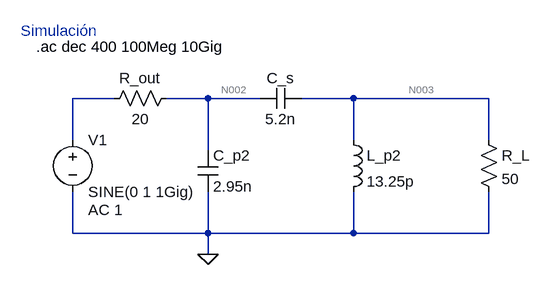
[diagram p0: schematic TP1 - Acoplamiento PI.asc]
TP1 - Acoplamiento PI.asc, the LTspice schematic file:
Version 4
SHEET 1 880 680
WIRE -192 16 -256 16
WIRE -48 16 -112 16
WIRE 32 16 -48 16
WIRE 176 16 96 16
WIRE 384 16 176 16
WIRE -256 80 -256 16
WIRE 176 80 176 16
WIRE 384 80 384 16
WIRE -48 96 -48 16
WIRE -256 224 -256 160
WIRE -48 224 -48 160
WIRE -48 224 -256 224
WIRE 176 224 176 160
WIRE 176 224 -48 224
WIRE 384 224 384 160
WIRE 384 224 176 224
WIRE -48 256 -48 224
FLAG -48 256 0
SYMBOL ind 160 64 R0
SYMATTR InstName L_p2
SYMATTR Value 13.25p
SYMBOL cap 96 0 R90
WINDOW 0 0 32 VBottom 2
WINDOW 3 32 32 VTop 2
SYMATTR InstName C_s
SYMATTR Value 5.2n
SYMBOL cap -64 96 R0
SYMATTR InstName C_p2
SYMATTR Value 2.95n
SYMBOL voltage -256 64 R0
WINDOW 123 24 124 Left 2
WINDOW 39 0 0 Left 0
SYMATTR InstName V1
SYMATTR Value SINE(0 1 1Gig)
SYMATTR Value2 AC 1
SYMBOL res 368 64 R0
SYMATTR InstName R_L
SYMATTR Value 50
SYMBOL res -96 0 R90
WINDOW 0 0 56 VBottom 2
WINDOW 3 32 56 VTop 2
SYMATTR InstName R_out
SYMATTR Value 20
TEXT -336 -88 Left 2 ;Simulación
TEXT -312 -64 Left 2 !.ac dec 400 100Meg 10Gig

The netlist it stands for:
* TP1 - Acoplamiento PI.asc
L_p2 N003 0 13.25p
C_s N003 N002 5.2n
C_p2 N002 0 2.95n
V1 N001 0 SINE(0 1 1Gig) AC 1
R_L N003 0 50
R_out N002 N001 20
* Simulación
.ac dec 400 100Meg 10Gig
.backanno
.end

* Results of the author's LTspice run, read from the files saved beside the schematic
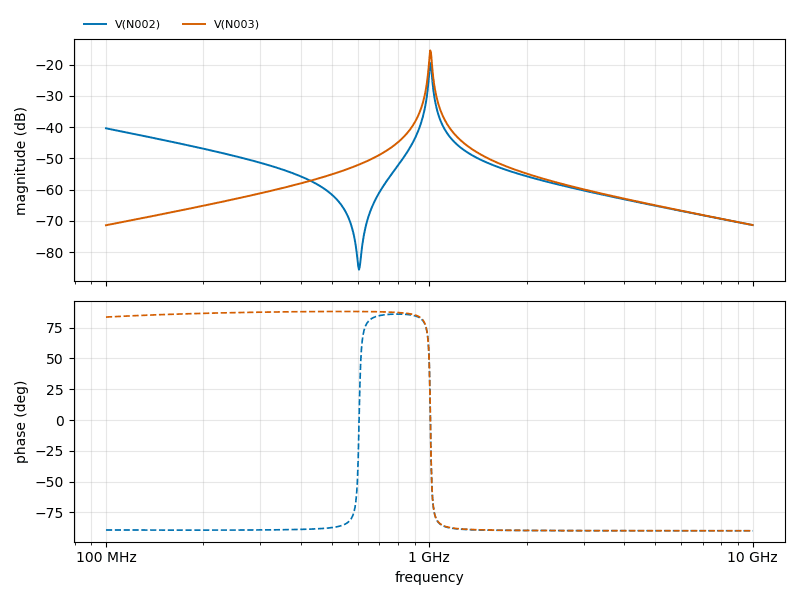
[diagram p1: AC Analysis of TP1 - Acoplamiento PI.asc, plotted from the saved traces]
* AC Analysis, 1 run:
*   V(N002): -40.36 dB at 100 MHz, -71.32 dB at 10 GHz, peak -19.36 dB at 1.006 GHz, 3 dB below the peak at 999.7 MHz and 1.016 GHz
*   V(N003): -71.37 dB at 100 MHz, -71.29 dB at 10 GHz, peak -15.44 dB at 1.006 GHz, 3 dB below the peak at 999.6 MHz and 1.016 GHz